# Altium schematic sheet [02] - Block Diagram.SchDoc: Block Diagram
size A3; DrawnBy: Farogh; Organization: Farogh Iftekhar; Address1: Defence Coloney; Address2: New Delhi; Revision: V1I0; SheetNumber: 2
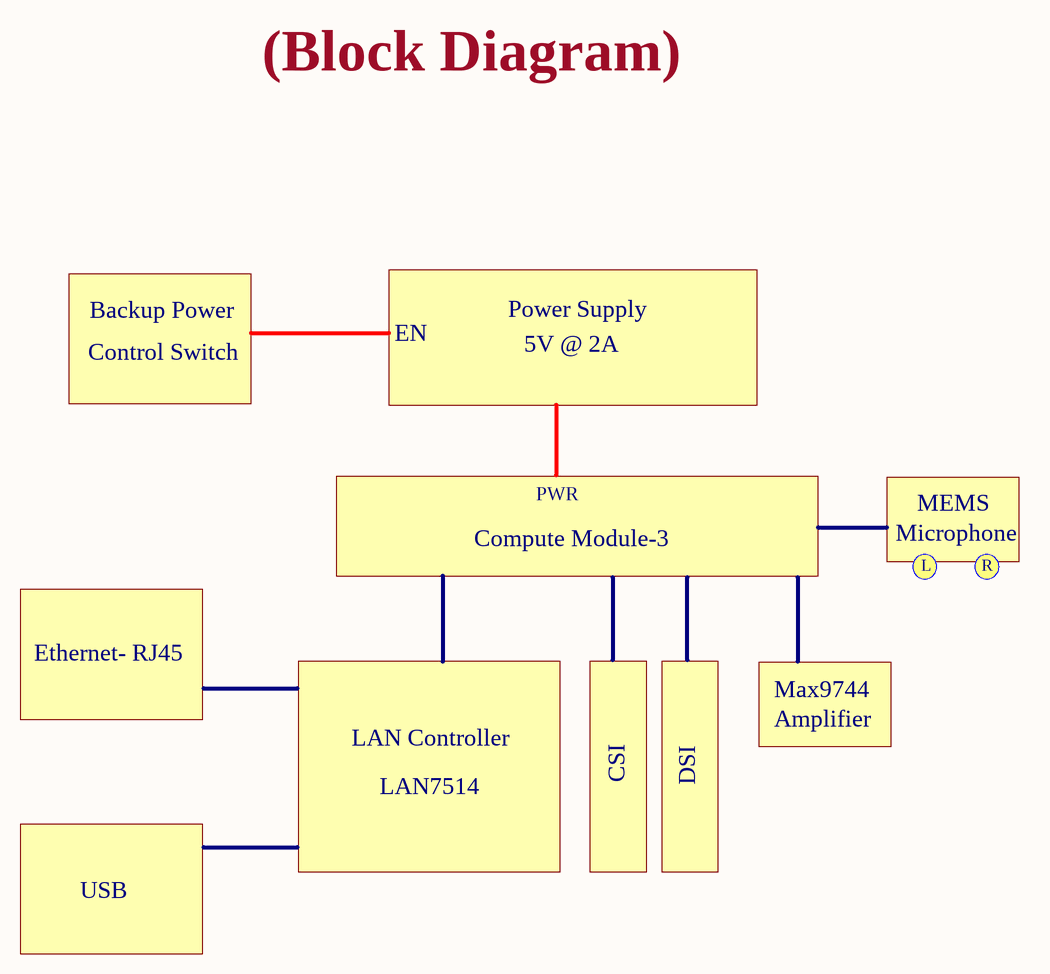
[diagram p0: [02] - Block Diagram.SchDoc]

## Notes on the sheet
- (Block Diagram)
- Backup Power
- Power Supply
- Control Switch
- EN
- 5V @ 2A
- PWR
- Microphone
- MEMS
- Compute Module-3
- L
- R
- Ethernet- RJ45
- Max9744
- Amplifier
- LAN Controller
- LAN7514
- CSI
- DSI
- USB
- Title
- Size:
- Date:
- A3
- Number:
- Time:
- Revision:
- Sheet
- of
- Approved By:
- Drawn By:
- ProjectName: